# EAGLE design main (EAGLE 9.5.1)
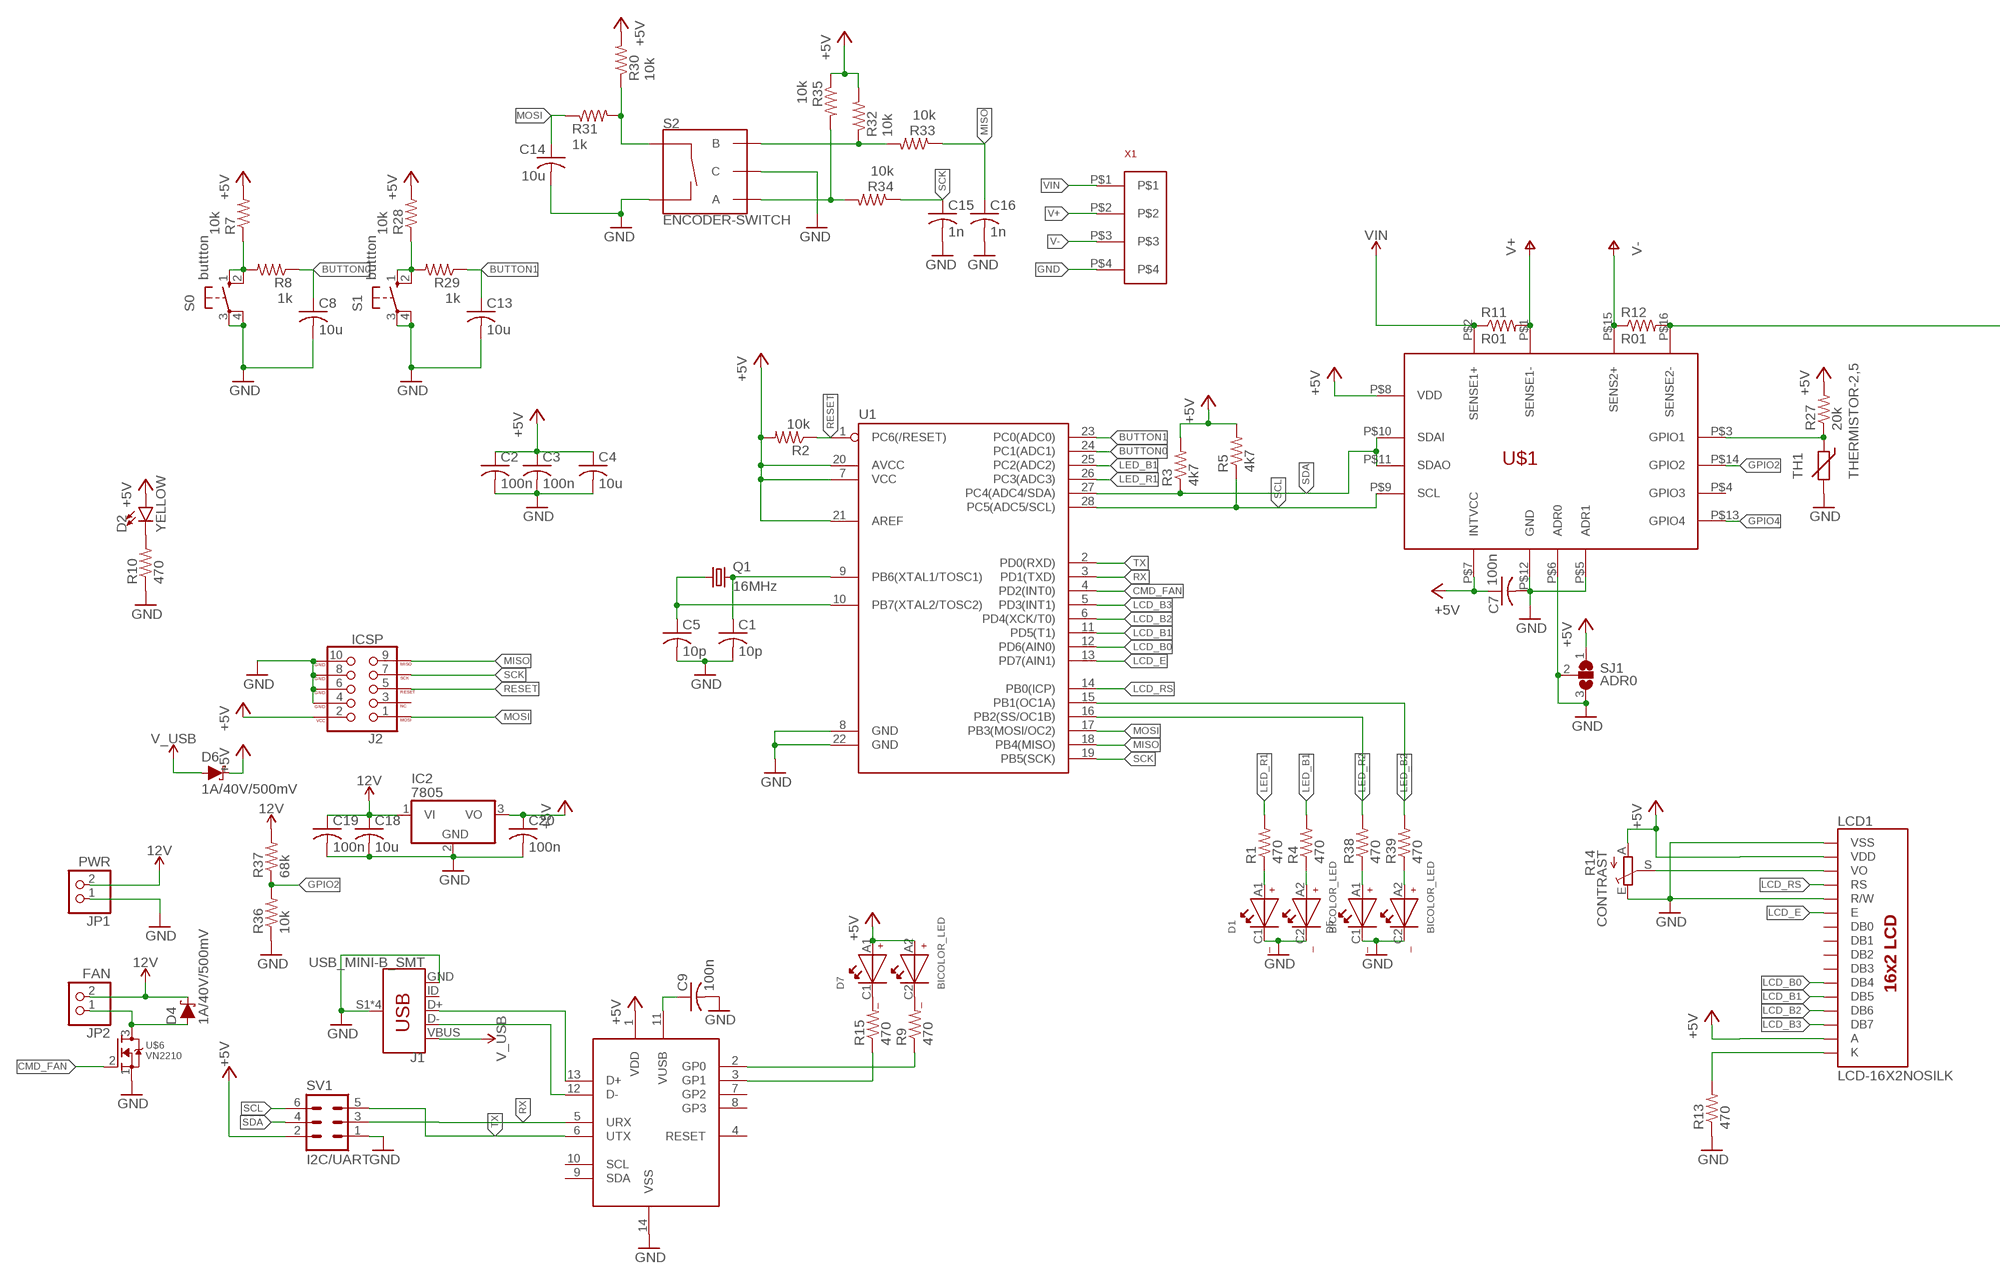
[diagram p0: schematic, sheet 1, part 1 of 2]
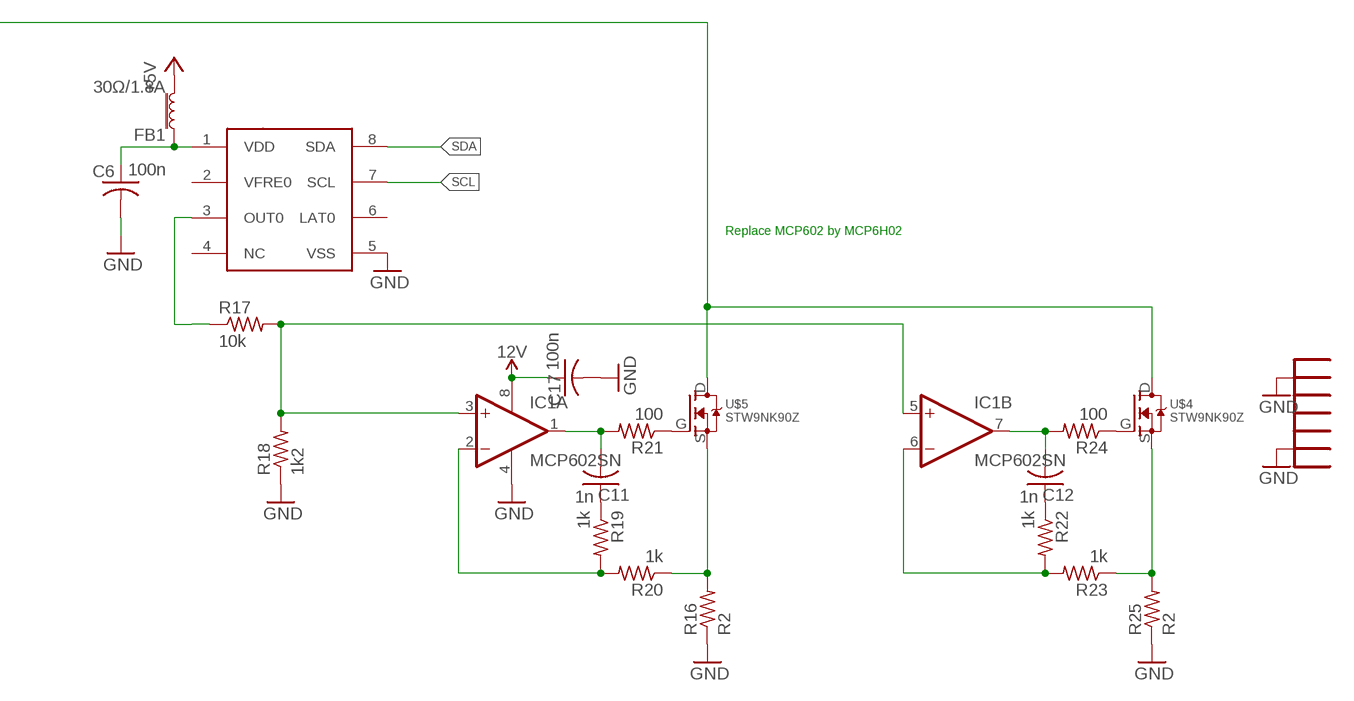
[diagram p1: schematic, sheet 1, part 2 of 2]

## Parts
BR1  MCP2221A  [DIP14]
C1  10p  C-USC0603  [C0603]
C2  100n  C-USC0603  [C0603]
C3  100n  C-USC0603  [C0603]
C4  10u  C-USC1206  [C1206]
C5  10p  C-USC0603  [C0603]
C6  100n  C-USC0603  [C0603]
C7  100n  C-USC0603  [C0603]
C8  10u  C-USC0603  [C0603]
C9  100n  C-USC0603  [C0603]
C11  1n  C-USC0805  [C0805]
C12  1n  C-USC0805  [C0805]
C13  10u  C-USC0603  [C0603]
C14  10u  C-USC0603  [C0603]
C15  1n  C-USC0603  [C0603]
C16  1n  C-USC0603  [C0603]
C17  100n  C-USC0603  [C0603]
C18  10u  C-USC1206  [C1206]
C19  100n  C-USC0603  [C0603]
C20  100n  C-USC0603  [C0603]
D1  BICOLOR_LED  [BICOLOR_LED]
D2  YELLOW  LED3MM  [LED_3MM]
D4  1A/40V/500mV  DIODE-SCHOTTKY-SS14  [SMA-DIODE]
D5  BICOLOR_LED  [BICOLOR_LED]
D6  1A/40V/500mV  DIODE-SCHOTTKY-SS14  [SMA-DIODE]
D7  BICOLOR_LED  [BICOLOR_LED]
FB1  30Ω/1.8A  FERRITE_BEAD-0603  [0603]
IC1  MCP602SN  [SO08]
IC2  7805  786TV  [TO220V]
J1  USB_MINI-B_SMT  [USB-MINIB]
J2  ICSP  AVR_SPI_PROG_5X2PTH2  [2X5-SHROUDED]
JP1  PWR  PINHD-1X2  [1X02]
JP2  FAN  PINHD-1X2  [1X02]
LCD1  LCD-16X2NOSILK  [LCD-16X2_NOSILK]
Q1  16MHz  CRYSTALHC49U70  [HC49U70]
R1  470  R-US_R0805  [R0805]
R2  10k  R-US_R0805  [R0805]
R3  4k7  R-US_R0805  [R0805]
R4  470  R-US_R0805  [R0805]
R5  4k7  R-US_R0805  [R0805]
R7  10k  R-US_R0805  [R0805]
R8  1k  R-US_R0805  [R0805]
R9  470  R-US_R0805  [R0805]
R10  470  R-US_R0805  [R0805]
R11  R01  R-US_R2512  [R2512]
R12  R01  R-US_R2512  [R2512]
R13  470  R-US_R0805  [R0805]
R14  CONTRAST  TRIM_EU-RJ9W  [RJ9W]
R15  470  R-US_R0805  [R0805]
R16  R2  R-US_R2512  [R2512]
R17  10k  R-US_R0805  [R0805]
R18  1k2  R-US_R0805  [R0805]
R19  1k  R-US_R0805  [R0805]
R20  1k  R-US_R0805  [R0805]
R21  100  R-US_R0805  [R0805]
R22  1k  R-US_R0805  [R0805]
R23  1k  R-US_R0805  [R0805]
R24  100  R-US_R0805  [R0805]
R25  R2  R-US_R2512  [R2512]
R27  20k  R-US_R0805  [R0805]
R28  10k  R-US_R0805  [R0805]
R29  1k  R-US_R0805  [R0805]
R30  10k  R-US_R0805  [R0805]
R31  1k  R-US_R0805  [R0805]
R32  10k  R-US_R0805  [R0805]
R33  10k  R-US_R0805  [R0805]
R34  10k  R-US_R0805  [R0805]
R35  10k  R-US_R0805  [R0805]
R36  10k  R-US_R0805  [R0805]
R37  68k  R-US_R0805  [R0805]
R38  470  R-US_R0805  [R0805]
R39  470  R-US_R0805  [R0805]
S0  buttton  10-XX  [B3F-10XX]
S1  buttton  10-XX  [B3F-10XX]
S2  ENCODER-SWITCH  [ROTARY_ENC_PLAIN]
SJ1  ADR0  SJ2W  [SJ_2]
SV1  I2C/UART  MA03-2  [MA03-2]
TH1  THERMISTOR-2,5  [RS-2,5]
U1  328P  ATMEGA328P_PDIP  [DIP28]
U$1  LTC2992  [MSOP16]
U$2  HEATSINK_0NOSILK  [HEATSINK_01]
U$3  MCP47FEB21  [TSSOP8]
U$4  STW9NK90Z  [TO247BV]
U$5  STW9NK90Z  [TO247BV]
U$6  VN2210  [TO92]
X1  SCREWTERM_5MM_4WAY  [SCREWTERM_5MM_4WAY]

## Nets
12V: C17.1 C18.1 C19.1 D4.C IC1.8(P:V+) IC2.1(VI) JP1.2 JP2.2 R37.2
+5V: BR1.1(VDD) C2.1 C3.1 C4.1 C7.1 C20.1 D2.A D6.C D7.A1 D7.A2 FB1.2 IC2.3(VO) J2.2(VCC) LCD1.2(VDD) LCD1.15(A) R2.2 R3.2 R5.2 R7.2 R14.A R27.2 R28.2 R30.2 R32.2 R35.1 SJ1.1 SV1.2 U1.7(VCC) U1.20(AVCC) U1.21(AREF) U$1.P$7(INTVCC) U$1.P$8(VDD)
B0: R7.1 R8.2 S0.1(S) S0.2(S1)
B1: R28.1 R29.2 S1.1(S) S1.2(S1)
BUTTON0: C8.1 R8.1 U1.24(PC1(ADC1))
BUTTON1: C13.1 R29.1 U1.23(PC0(ADC0))
CMD_FAN: U1.4(PD2(INT0)) U$6.2(G)
D+: BR1.13(D+) J1.D+
D-: BR1.12(D-) J1.D-
DAC_OUT: R17.1 U$3.3(OUT0)
FANNEG: D4.A JP2.1 U$6.3(D)
GND: BR1.14(VSS) C1.2 C2.2 C3.2 C4.2 C5.2 C6.2 C7.2 C8.2 C9.2 C13.2 C14.2 C15.2 C16.2 C17.2 C18.2 C19.2 C20.2 D1.C1 D1.C2 D5.C1 D5.C2 IC1.4(P:V-) IC2.2(GND) J1.GND J1.S1(SHIELD) J1.S2(SHIELD) J1.S3(SHIELD) J1.S4(SHIELD) J2.4(GND) J2.6(GND) J2.8(GND) J2.10(GND) JP1.1 LCD1.1(VSS) LCD1.5(R/W) R10.1 R13.1 R14.E R16.1 R18.1 R25.1 R36.1 S0.3(P) S0.4(P1) S1.3(P) S1.4(P1) S2.C S2.SW- SJ1.2 SJ1.3 SV1.1 TH1.2 U1.8(GND) U1.22(GND) U$1.P$5(ADR1) U$1.P$6(ADR0) U$1.P$12(GND) U$2.P$1 U$2.P$2 U$3.5(VSS) U$6.1(S) X1.P$4
GPIO2: R36.2 R37.1 U$1.P$14(GPIO2)
GPIO4: U$1.P$13(GPIO4)
LCD1_CONTRAST: LCD1.3(VO) R14.S
LCD1_K: LCD1.16(K) R13.2
LCD_B0: LCD1.11(DB4) U1.12(PD6(AIN0))
LCD_B1: LCD1.12(DB5) U1.11(PD5(T1))
LCD_B2: LCD1.13(DB6) U1.6(PD4(XCK/T0))
LCD_B3: LCD1.14(DB7) U1.5(PD3(INT1))
LCD_E: LCD1.6(E) U1.13(PD7(AIN1))
LCD_RS: LCD1.4(RS) U1.14(PB0(ICP))
LED_B1: R4.2 U1.25(PC2(ADC2))
LED_B2: R39.2 U1.15(PB1(OC1A))
LED_R1: R1.2 U1.26(PC3(ADC3))
LED_R2: R38.2 U1.16(PB2(SS/OC1B))
MISO: C16.1 J2.9(MISO) R33.1 U1.18(PB4(MISO))
MOSI: C14.1 J2.1(MOSI) R31.1 U1.17(PB3(MOSI/OC2))
N$1: C1.1 Q1.2 U1.9(PB6(XTAL1/TOSC1))
N$2: C5.1 Q1.1 U1.10(PB7(XTAL2/TOSC2))
N$3: C6.1 FB1.1 U$3.1(VDD)
N$4: D5.A1 R38.1
N$5: D5.A2 R39.1
N$6: D1.A1 R1.1
N$7: R21.1 U$5.G
N$8: D1.A2 R4.1
N$9: BR1.2(GP0) R9.1
N$10: BR1.11(VUSB) C9.1
N$11: BR1.3(GP1) R15.1
N$12: D7.C1 R15.2
N$13: D7.C2 R9.2
N$14: D2.K(C) R10.2
N$20: C11.1 R19.1
N$23: C12.1 R22.1
N$29: R12.2 U$1.P$16(SENSE2-) U$4.D U$5.D
RESET: J2.5(RESET) R2.1 U1.1(PC6(/RESET))
RX: BR1.5(URX) SV1.3 U1.3(PD1(TXD))
SCK: C15.1 J2.7(SCK) R34.1 U1.19(PB5(SCK))
SCL: R5.1 SV1.6 U1.28(PC5(ADC5/SCL)) U$1.P$9(SCL) U$3.7(SCL)
SDA: R3.1 SV1.4 U1.27(PC4(ADC4/SDA)) U$1.P$10(SDAI) U$1.P$11(SDAO) U$3.8(SDA)
TX: BR1.6(UTX) SV1.5 U1.2(PD0(RXD))
V+: R11.2 U$1.P$1(SENSE1-) X1.P$2
V-: R12.1 U$1.P$15(SENS2+) X1.P$3
V_USB: D6.A J1.VBUS
VCTRL: IC1.3(A:+IN) IC1.5(B:+IN) R17.2 R18.2
VENC: R30.1 R31.2 S2.SW+
VENCA: R34.2 R35.2 S2.A
VENCB: R32.1 R33.2 S2.B
VFB1: IC1.2(A:-IN) R19.2 R20.2
VFB2: IC1.6(B:-IN) R22.2 R23.2
VG2: R24.1 U$4.G
VIN: R11.1 U$1.P$2(SENSE1+) X1.P$1
VO1: C11.2 IC1.1(A:OUT) R21.2
VO2: C12.2 IC1.7(B:OUT) R24.2
VS1: R16.2 R20.1 U$5.S
VS2: R23.1 R25.2 U$4.S
VT: R27.1 TH1.1 U$1.P$3(GPIO1)
Unconnected: BR1.4(RESET) BR1.7(GP2) BR1.8(GP3) BR1.9(SDA) BR1.10(SCL) J1.ID J2.3(NC) LCD1.7(DB0) LCD1.8(DB1) LCD1.9(DB2) LCD1.10(DB3) U$1.P$4(GPIO3) U$3.2(VFRE0) U$3.4(NC) U$3.6(LAT0)

## Notes on the sheet
- Replace MCP602 by MCP6H02

## Library data of the parts
BR1 = 7_segment_lib:MCP2221A
C1-C9 C11-C20 = rcl:C-US: CAPACITOR, American symbol; SPICEPREFIX: C
D1 D5 D7 = 7_segment_lib:BICOLOR_LED
D2 = SparkFun-LED:LED: LED (Generic) Standard schematic elements and footprints for 5mm, 3mm, 1206, and 0603 sized LEDs. Generic LEDs with no color specified.; PROD_ID: DIO-08794
D4 D6 = SparkFun-DiscreteSemi:DIODE-SCHOTTKY: Schottky diode A Schottky diode is a semiconductor diode which has a low forward voltage drop and a very fast switching action.; PROD_ID: DIO-08053
FB1 = SparkFun-Coils:FERRITE_BEAD: Ferrite Bead (blocks, cores, rings, chokes, etc.) Inductor with layers of ferrite used to suppress high frequencies. Often used to isolate high frequency noise. SparkFun Products: IOIO-OTG - V2.2 <https://www.sparkfun.com/products/13613> SparkFun SAMD21 Mini Breakout <https://www.sparkfun.com/products/13664> SparkFun 6 Degrees of Freedom Breakout - LSM6DS3 <https://www.sparkfun.com/products/13339> SparkFun SAMD21 Dev Breakout <https://www.sparkfun.com/products/13672>; PROD_ID: NDUC-07859
IC1 = linear:MCP602: Single Op Amp 2.7V to 6.0V Single Supply CMOS Source: http://ww1.microchip.com/downloads/en/DeviceDoc/21314g.pdf
IC2 = linear:78*: Positive VOLTAGE REGULATOR Source: http://cache.national.com/ds/LM/LM78L05.pdf http://www.fairchildsemi.com/ds/LM/LM7805.pdf
J1 = SparkFun-Connectors:USB_MINI-B: USB type Mini-B Connector Breaks out 5th pin, and includes shield pins if needed. SparkFun Products: SparkFun FTDI Basic Breakout <https://www.sparkfun.com/products/9716> SparkFun XBee Explorer USB <https://www.sparkfun.com/products/11812> SparkFun Redboard <https://www.sparkfun.com/products/12757>; PROD_ID: CONN-08193; SF_ID: PRT-00587
J2 = SparkFun-Connectors:AVR_SPI_PROG_5X2: AVR 10-pin ICSP Header This is the standard AVR In Circuit Serial Programming header. Minimal, but includes pin one indicator. Works with standard Olimex programmers. SparkFun Products: 2x5 AVR ICSP Male Header <https://www.sparkfun.com/products/778> - PTH 2x5 Pin Shrouded Header <https://www.sparkfun.com/products/8506> - PTH2; PROD_ID: CONN-08671; SF_ID: PRT-08506
JP1 JP2 = pinhead:PINHD-1X2: PIN HEADER
LCD1 = 7_segment_lib:LCD-16X2: Standard text-only 16x2 parallel input LCD Basic 16 character by 2 line display. Typically utilizes the extremely common HD44780 parallel interface chipset SparkFun Products: Basic 16x2 Green <https://www.sparkfun.com/products/255> Basic 8x2 Green <https://www.sparkfun.com/products/11122>; SF_ID: LCD-00255
Q1 = crystal:CRYSTAL: CRYSTAL; OC_FARNELL: unknown; OC_NEWARK: unknown
R1-R5 R7-R13 R15-R25 R27-R39 = rcl:R-US_: RESISTOR, American symbol; SPICEPREFIX: R
R14 = pot:TRIM_EU-: POTENTIOMETER
S0 S1 = DC_LOAD_AU:10-XX: OMRON SWITCH; MPN: B3F-1000; OC_FARNELL: 176432; OC_NEWARK: 36M3542
S2 = SparkFun-Switches:ENCODER-SWITCH: Rotary Encoder w/ Select Switch Encoders rotate similarly to potentiometers, but they’re different from potentiometers in that an encoder has full rotation without limits. They output gray code so that you can tell how much and in which direction the encoder has been turned. This encoder includes a push-down select switch built into the shaft. SparkFun Products Rotary Encoder <https://www.sparkfun.com/products/9117> (COM-09117); SF_SKU: COM-09117
SJ1 = jumper:SJ2W: SMD solder JUMPER
SV1 = con-lstb:MA03-2: PIN HEADER; OC_FARNELL: unknown; OC_NEWARK: unknown
TH1 = varistor:THERMISTOR: THERMISTOR
U1 = 7_segment_lib:ATMEGA328P_PDIP: Atmel 328P Through hole ATMEGA328P uC used in the Arduino 32kb flash, 1k EEPROM, 2k SRAM Datasheet <http://www.sparkfun.com/datasheets/Components/SMD/ATMega328.pdf> SparkFun Products Storefront component: AVR 28 Pin 20MHz 32K 6A/D - ATMega328P <https://www.sparkfun.com/products/9061> (COM-09061) SparkFun Simon Says - Through-Hole Soldering Kit <https://www.sparkfun.com/products/10547> (KIT-10547) SparkFun Learn to Solder - Simon Says <https://www.sparkfun.com/products/13708> (KIT-13708) SparkFun BigTime Watch Kit <https://www.sparkfun.com/products/11734> (KIT-11734) SparkFun ClockIt <https://www.sparkfun.com/products/10930> (KIT-10930) SparkFun Serial Enabled LCD Kit <https://www.sparkfun.com/products/10097> (LCD-10097) SparkFun Simon Tilts - Through Hole Soldering Kit <https://www.sparkfun.com/products/12634> (KIT-12634) SparkFun Frequency Counter Kit <https://www.sparkfun.com/products/10140> (KIT-10140) FabFM Radio Kit <https://www.sparkfun.com/products/11043> (KIT-11043) SparkFun Binary Blaster Kit <https://www.sparkfun.com/products/12037> (KIT-12037) SparkFun Metro-Gnome <https://www.sparkfun.com/products/9236> (KIT-09236) ATmega328 with Arduino Optiboot (Uno) <https://www.sparkfun.com/products/10524> (DEV-10524); PROD_ID: IC-09136
U$1 = 7_segment_lib:LTC2992
U$2 = 7_segment_lib:HEATSINK_0
U$3 = 7_segment_lib:MCP47FEB21
U$4 U$5 = 7_segment_lib:STW9NK90Z
U$6 = 7_segment_lib:VN2210
X1 = 7_segment_lib:SCREWTERM_5MM_4WAY

## Board
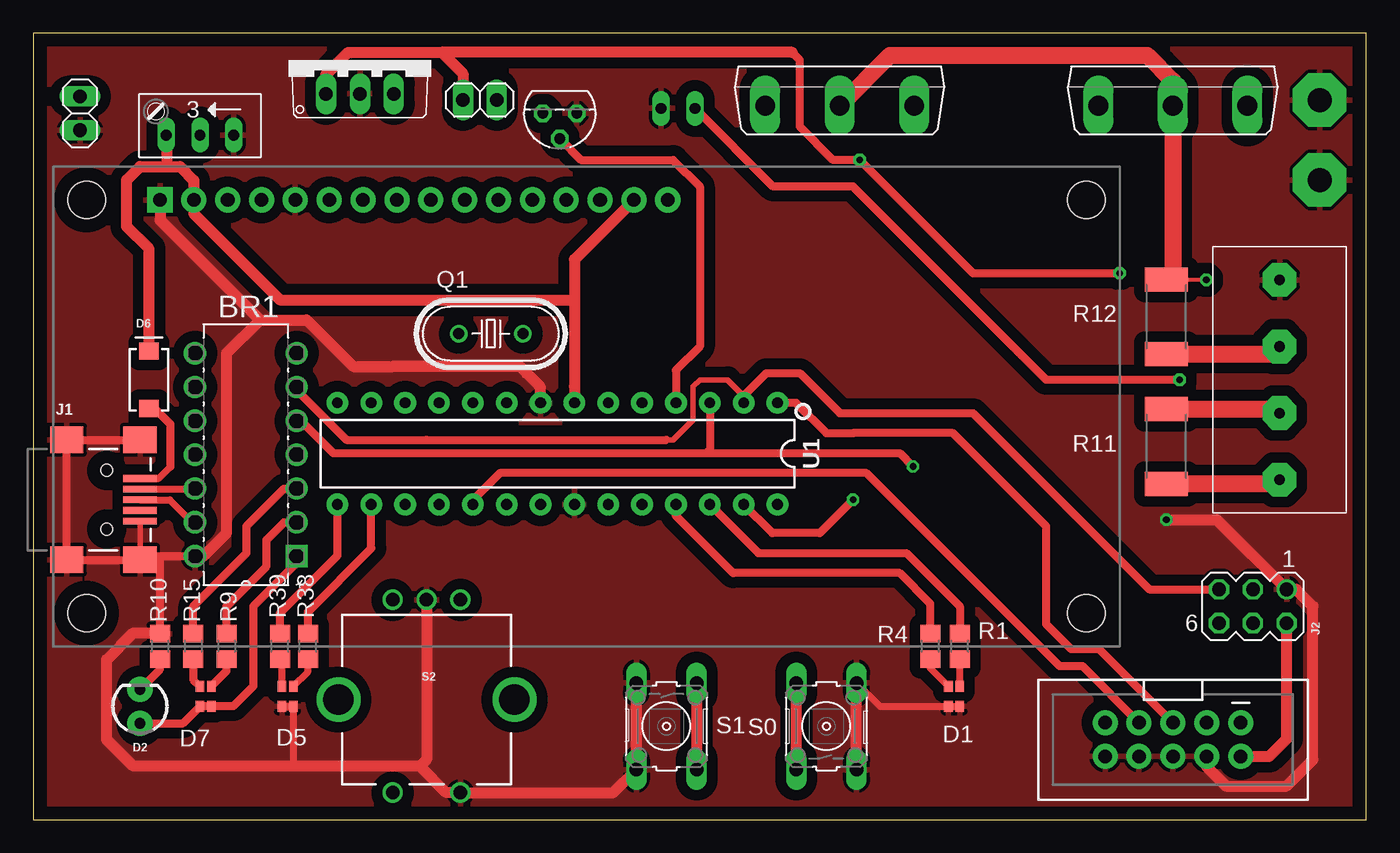
[diagram p2: board, top side]
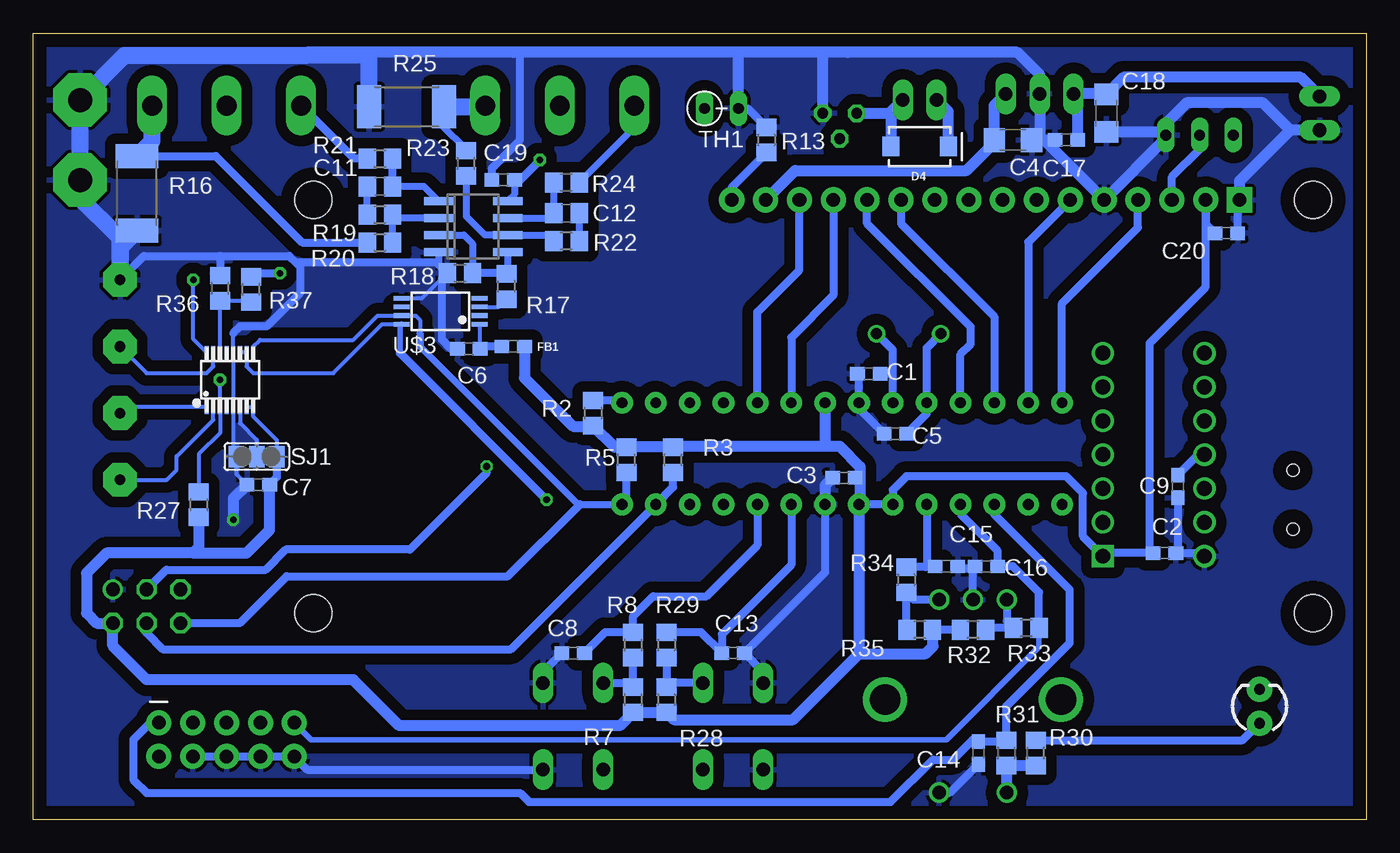
[diagram p3: board, bottom side, seen from below]

Size 100 x 59 mm. Coordinates in mm from the lower left corner, seen from the top.
Outline: 0,0 100,0 100,59 0,59 0,0
Copper layers (1*16): Top 0.035mm / dielectric 1.5mm / Bottom 0.035mm
Design rules "default": minimum track width 6mil, minimum drill 0.35mm, track to track 6mil, track to pad 6mil, pad to pad 6mil, via to via 6mil, smd to smd 6mil, copper to edge 40mil, drill to drill 6mil, minimum pad ring 10mil, minimum via ring 8mil, stop-mask expansion 4mil, vias tented up to drill 0mil, thermal gap 10mil

### Footprints (pad centres in the part's own frame; a part is rotated, then mirrored left to right if it is on the bottom)
DIP14 = drill 1.118 square: 1 -7.62,15.24 | drill 1.118: 2 -7.62,12.7; 3 -7.62,10.16; 4 -7.62,7.62; 5 -7.62,5.08; 6 -7.62,2.54; 7 -7.62,0; 8 0,0; 9 0,2.54; 10 0,5.08; 11 0,7.62; 12 0,10.16; 13 0,12.7; 14 0,15.24
C0603 = smd 1.1 x 1: 1 -0.85,0; 2 0.85,0
C1206 = smd 1.6 x 1.8: 1 -1.4,0; 2 1.4,0
C0805 = smd 1.3 x 1.5: 1 -0.95,0; 2 0.95,0
BICOLOR_LED = smd 0.8 x 0.65: A1 0,0; A2 0,-0.85; C1 1.5,0; C2 1.5,-0.85
LED_3MM = drill 0.813 pad 1.88: A -1.27,0; K 1.27,0
SMA-DIODE = smd 1.27 x 1.47: A -2.15,0; C 2.15,0
0603 = smd 1.1 x 1: 1 -0.85,0; 2 0.85,0
SO08 = smd 0.6 x 2.2: 1 -1.905,-2.6; 2 -0.635,-2.6; 3 0.635,-2.6; 4 1.905,-2.6; 5 1.905,2.6; 6 0.635,2.6; 7 -0.635,2.6; 8 -1.905,2.6
TO220V = drill 1.016 long: 1 -2.54,-2.54; 2 0,-2.54; 3 2.54,-2.54
USB-MINIB = smd 2.5 x 0.5: D+ 2.5,0; D- 2.5,0.8; GND 2.5,-1.6; ID 2.5,-0.8; VBUS 2.5,1.6 | smd 2.5 x 2: S1 -3,4.5; S2 2.5,4.5; S3 -3,-4.5; S4 2.5,-4.5 | hole 0.9: 0,2.2; 0,-2.2
2X5-SHROUDED = drill 1.016 pad 1.88: 1 -1.27,5.08; 2 1.27,5.08; 3 -1.27,2.54; 4 1.27,2.54; 5 -1.27,0; 6 1.27,0; 7 -1.27,-2.54; 8 1.27,-2.54; 9 -1.27,-5.08; 10 1.27,-5.08
1X02 = drill 1.016 long: 1 -1.27,0; 2 1.27,0
LCD-16X2_NOSILK = drill 1.016 pad 1.88 square: 1 -32,15.5 | drill 1.016 pad 1.88: 2 -29.46,15.5; 3 -26.92,15.5; 4 -24.38,15.5; 5 -21.84,15.5; 6 -19.3,15.5; 7 -16.76,15.5; 8 -14.22,15.5; 9 -11.68,15.5; 10 -9.14,15.5; 11 -6.6,15.5; 12 -4.06,15.5; 13 -1.52,15.5; 14 1.02,15.5; 15 3.56,15.5; 16 6.1,15.5 | hole 2.8: -37.5,15.5; -37.5,-15.5; 37.5,15.5; 37.5,-15.5
HC49U70 = drill 0.813: 1 -2.413,0; 2 2.413,0
R0805 = smd 1.3 x 1.5: 1 -0.95,0; 2 0.95,0
R2512 = smd 1.8 x 3.2: 1 -2.8,0; 2 2.8,0
RJ9W = drill 0.813 long: A 2.54,0.635; E -2.54,0.635; S 0,0.635
B3F-10XX = drill 1.016 long: 1 -3.251,2.261; 2 3.251,2.261; 3 -3.251,-2.261; 4 3.251,-2.261
ROTARY_ENC_PLAIN = drill 1.016: A 7.493,-2.54; B 7.493,2.54; C 7.493,0; SW+ -6.985,2.54; SW- -6.985,-2.54 | drill 2.286: P$3 0,6.604; P$4 0,-6.604
SJ_2 = smd 1.168 x 1.6: 1 -1.524,0; 2 0,0; 3 1.524,0
MA03-2 = drill 1.016: 1 -2.54,-1.27 | drill 1.016 octagon: 2 -2.54,1.27; 3 0,-1.27; 4 0,1.27; 5 2.54,-1.27; 6 2.54,1.27
RS-2,5 = drill 0.813 long: 1 -1.27,0; 2 1.27,0
DIP28 = drill 0.813 pad 1.626: 1 -16.51,-3.81; 2 -13.97,-3.81; 3 -11.43,-3.81; 4 -8.89,-3.81; 5 -6.35,-3.81; 6 -3.81,-3.81; 7 -1.27,-3.81; 8 1.27,-3.81; 9 3.81,-3.81; 10 6.35,-3.81; 11 8.89,-3.81; 12 11.43,-3.81; 13 13.97,-3.81; 14 16.51,-3.81; 15 16.51,3.81; 16 13.97,3.81; 17 11.43,3.81; 18 8.89,3.81; 19 6.35,3.81; 20 3.81,3.81; 21 1.27,3.81; 22 -1.27,3.81; 23 -3.81,3.81; 24 -6.35,3.81; 25 -8.89,3.81; 26 -11.43,3.81; 27 -13.97,3.81; 28 -16.51,3.81
MSOP16 = smd 0.3 x 1: P$1 -1,-2.05; P$2 -0.5,-2.05; P$3 0,-2.05; P$4 0.5,-2.05; P$5 1,-2.05; P$6 1.5,-2.05; P$7 2,-2.05; P$8 2.5,-2.05; P$9 2.5,2.05; P$10 2,2.05; P$11 1.5,2.05; P$12 1,2.05; P$13 0.5,2.05; P$14 0,2.05; P$15 -0.5,2.05; P$16 -1,2.05
HEATSINK_01 = drill 1.8 pad 4 octagon: P$1 0,-3; P$2 0,-9
TSSOP8 = smd 0.35 x 1.2: 1 -0.975,-2.925; 2 -0.325,-2.925; 3 0.325,-2.925; 4 0.975,-2.925; 5 0.975,2.925; 6 0.325,2.925; 7 -0.325,2.925; 8 -0.975,2.925
TO247BV = drill 1.499 long: D 0,-2.921; G -5.588,-2.921; S 5.588,-2.921
TO92 = drill 0.813 octagon: 1 -1.27,0; 2 0,1.905; 3 1.27,0
SCREWTERM_5MM_4WAY = drill 0.8 pad 2.54 octagon: P$1 -7.5,0; P$2 -2.5,0; P$3 2.5,0; P$4 7.5,0

### Placement (x,y rotation side)
BR1  12.13,35 180 top
C1  37.33,33.46 180 bottom
C2  15.13,20 0 bottom
C3  39.18,25.64 180 bottom
C4  26.5,51 0 bottom
C5  35.33,28.96 180 bottom
C6  67.33,35.33 180 bottom
C7  83.12,25.12 180 bottom
C8  59.5,12.5 180 bottom
C9  14.13,25 270 bottom
C11  74,47.5 0 bottom
C12  60,45.5 180 bottom
C13  47.5,12.5 0 bottom
C14  29.1,5 270 bottom
C15  31.5,19 0 bottom
C16  28.5,19 180 bottom
C17  22.5,51 180 bottom
C18  19.5,53 270 bottom
C19  64.75,48 180 bottom
C20  10.5,44 0 bottom
D1  69.5,10 270 top
D2  8,8.5 90 top
D4  33.5,50.5 0 bottom
D5  19.5,10 270 top
D6  8.68,33 90 top
D7  12.5,8.5 90 top
FB1  64,35.5 0 bottom
IC1  67,44.5 270 bottom
IC2  24.5,57 0 top
J1  5.5,24 0 top
J2  85.5,6 270 top
JP1  3.5,53 90 top
JP2  33.5,54 180 top
LCD1  41.5,31 0 top
Q1  34.33,36.46 0 top
R1  69.5,13 90 top
R2  58,30.5 270 bottom
R3  52,27 90 bottom
R4  67.3,13 90 top
R5  55.5,27 90 bottom
R7  55,9 270 bottom
R8  55,13.1 270 bottom
R9  14.5,13 270 top
R10  9.5,13 270 top
R11  85,28 90 top
R12  85,37.73 90 top
R13  45,51 270 bottom
R14  12.5,52 180 top
R15  12,13 270 top
R16  92.22,46.98 90 bottom
R17  64.5,40 90 bottom
R18  68,41 0 bottom
R19  74,45.4 0 bottom
R20  74,43.3 0 bottom
R21  74,49.6 0 bottom
R22  60,43.4 180 bottom
R23  67.55,49.25 270 bottom
R24  60,47.8 180 bottom
R25  72,53.5 0 bottom
R27  87.58,23.64 270 bottom
R28  52.5,9 270 bottom
R29  52.5,13.1 270 bottom
R30  24.8,5 90 bottom
R31  27,5 270 bottom
R32  29.5,14.25 180 bottom
R33  25.5,14.36 180 bottom
R34  34.5,18 270 bottom
R35  33.5,14.25 180 bottom
R36  86,39.87 270 bottom
R37  83.64,39.78 90 bottom
R38  20.6,13 90 top
R39  18.5,13 90 top
S0  59.5,7 90 top
S1  47.5,7 270 top
S2  29.5,9 90 top
SJ1  83.23,27.23 180 bottom
SV1  91.5,16 180 top
TH1  48.37,53.37 0 bottom
U1  39.33,27.46 180 top
U$1  86,33 0 bottom
U$2  96.5,57 0 top
U$3  69.45,38.14 90 bottom
U$4  60.5,56.5 0 top
U$5  85.5,56.5 0 top
U$6  39.5,53 180 top
X1  93.5,33 90 top

### Tracks (layer width: path | path; a pad name or v marks a point on that pad's centre or on a via)
12V  (via drill 0.5)
  Top 0.61: 56.92,57.58 57.5,57 57.5,52 60,49.5 v62,49.5 70.5,41 v81.5,41
  Top 0.813: IC2.1 21.96,55.91 23.63,57.58 30.63,57.58 | JP2.2 32.23,55.98 30.63,57.58 | 56.92,57.58 30.63,57.58
  Bottom 0.508: C19.1 63.9,46.91 IC1.8
  Bottom 0.61: C19.1 63.5,48 v62,49.5 | R37.2 83.38,41 v81.5,41
  Bottom 0.813: C17.1 21.65,54.15 IC2.1 19.56,54.46 C18.1 18.21,55.69 4.92,55.69 JP1.2 | D4.C 31.35,53.12 JP2.2
+5V
  Top 0.61: D2.A 11.23,7.23 D7.A1 D7.A2 15,8.5 16.5,10 16.5,16 19.75,19.25 BR1.1
  Top 0.813: D6.C 8.68,42.83 7,44.5 7,48 8,49 10,49 | 10,49 11,49 12.04,47.96 LCD1.2 12.04,45.46 18.5,39 40.59,39 | R14.A 10,51.33 10,49 | U1.7 40.59,32.5 40.59,39 | LCD1.15 40.59,42.03 40.59,39 | J2.2 92.73,4.73 94.04,6.04 SV1.2
  Bottom 0.305: U$1.P$7 U$1.P$8 83.5,30.25 81.71,28.46 SJ1.1
  Bottom 0.61: C20.1 12.04,44.69 LCD1.2 12.04,39.96 16.25,35.75 16.25,20.27 C2.1 19.52,20 BR1.1 21.25,21.25 21.25,24.5 22.5,25.75 34.5,25.75 35.52,24.73 U1.20 U1.21 | R32.2 R35.1 | C7.1 81.71,25.69 SJ1.1 | R30.2 9.28,5.95 D2.A
  Bottom 0.813: IC2.3 27.9,53.6 C4.1 27.9,50.78 29.98,48.7 42.85,48.7 LCD1.15 | 38.05,12.45 U1.21 37.98,23.73 37.98,25.5 | 38.05,12.45 43,7.5 51.95,7.5 R28.2 R7.2 56,7.05 72.55,7.05 76,10.5 91.5,10.5 94.04,13.04 SV1.2 95.23,14.73 96,15.5 96,18.5 94.5,20 88,20 | 38.05,12.45 33.05,12.45 32.5,13 32.5,14.2 R35.1 | 40.5,28 39.5,28 37.98,26.48 37.98,25.5 | 40.5,28 51.95,28 R3.2 R5.2 56.4,27.95 R2.2 58.05,29.5 59.5,29.5 63.15,33.15 FB1.2 | U1.7 40.59,28.09 40.5,28 | R27.2 87.58,20.42 88,20 | C7.1 82.28,21.73 84,20 88,20 | C3.1 38.19,25.5 37.98,25.5
B0
  Top 0.813: S0.1 S0.2
  Bottom 0.61: R7.1 55,10 | 55,10 R8.2 | S0.2 55,10.25 55,10
B1
  Top 0.813: S1.1 S1.2
  Bottom 0.61: R29.2 52.5,10.5 | 52.5,10.5 R28.1 | S1.1 52.5,10.25 52.5,10.5
BUTTON0
  Bottom 0.61: C8.1 57.1,14.05 R8.1 55,15.25 53.5,16.75 49.5,16.75 45.67,20.57 U1.24
BUTTON1
  Bottom 0.61: R29.1 49.9,14.05 C13.1 48.35,13.9 43.13,19.11 U1.23
CMD_FAN
  Top 0.61: U$6.2 41.09,49.5 48,49.5 50,47.5 50,35.5 48.22,33.72 U1.4
D+
  Top 0.508: J1.D+ 10.23,24 11.94,22.3 BR1.13
D-
  Top 0.508: J1.D- 12.1,24.8 BR1.12
DAC_OUT
  Bottom 0.305: U$3.3 65.08,38.47 R17.1
FANNEG
  Bottom 0.813: JP2.1 35.65,53.12 | 35.65,53.12 D4.A | U$6.3 35.77,53 35.65,53.12
GND  (via drill 0.5)
  Top 0.406: J1.GND 8,19.75 7.76,19.5
  Top 0.508: D1.C1 D1.C2 63.51,8.5 S0.4 | D5.C1 19.5,4
  Top 0.61: J1.S4 7.76,19.5 J1.S3 J1.S1 J1.S2 | BR1.14 10.93,19.76 9.5,19.76 | 9.5,19.76 8.02,19.76 8,19.75 | R10.1 9.5,19.76 | D5.C2 D5.C1
  Top 0.813: U1.8 38.05,32.45 37,33.5 36.5,34 27,34 24,34 20.5,37.5 17,37.5 | LCD1.1 9.5,45 17,37.5 | 29,4 30.98,2.01 S2.SW- 43.51,2.01 S1.4 S1.3 | R10.1 9.45,14 7.5,14 5.5,12 5.5,6 7.5,4 19.5,4 29,4 | S2.C 29.5,4.5 29,4 | BR1.14 12.76,19.76 14.5,21.5 14.5,35 17,37.5 | S0.3 S0.4 | J2.4 88.04,3.96 89.5,2.5 94,2.5 96,4.5 96,16 94.73,17.27 SV1.1 88.81,22.5 v85,22.5
  Bottom 0.254: SJ1.2 SJ1.3
  Bottom 0.305: U$3.5 70.83,39.12 R18.1 | C7.2 84.76,25.91 SJ1.3 85,27.47 U$1.P$5 U$1.P$12 85,36.5 84.5,37 82.5,37 | 80.25,39.25 80,39.5 80,41.5 | U$1.P$6 84.5,29.75 83.23,28.48 SJ1.2
  Bottom 0.508: IC1.4 69.6,41.65 R18.1
  Bottom 0.61: C20.2 9.65,46.35 LCD1.1 | C1.2 38.05,33.34 U1.8 38.05,30.84 C5.2 | 40.59,25.04 U1.22 40.59,18.55 C13.2 45.24,11.09 S1.3 | C8.2 61.76,11.09 S0.4 | C2.2 14.11,20 | 14.11,20 12.38,20 BR1.14 | C9.2 14.13,20.03 14.11,20 | S2.C 29.5,18.85 | 29.5,18.85 C16.2 | C15.2 30.5,18.85 29.5,18.85 | J2.4 J2.6 J2.8 J2.10 79.44,3.75 S0.3 | 86,42.3 R36.1 | X1.P$4 91.7,42.3 86,42.3 | S2.SW- 31.23,2.01 C14.2 | C19.2 65.6,48.9 63.5,51 63.5,57.58 | TH1.2 46.41,53.37 R13.1 | 86,42.3 80.8,42.3 80.3,41.8 | 80.3,41.8 80,41.5 80,39.5 80.25,39.25 82.5,37 84.5,37 85,36.5 | 80.3,41.8 69.75,41.8 R18.1 69.35,40.6 69.35,36.01 68.67,35.33 C6.2
  Bottom 0.813: C17.2 24.27,51 | 24.27,51 C4.2 | 24.27,51 24.16,51 LCD1.5 15.04,51.12 | 15.04,51.12 R14.E 15.28,51.6 C18.2 | 24.27,51 24.5,51.23 IC2.2 24.5,55.91 26.17,57.58 38.89,57.58 40.77,57.58 | U$6.1 40.77,57.58 | 79.51,57.35 79.28,57.58 78.88,57.58 64,57.58 63.5,57.58 47.12,57.58 | 40.77,57.58 47.12,57.58 | TH1.2 47.1,57.58 47.12,57.58 | JP1.1 5.7,51.73 | 15.04,51.12 15.04,52.22 13.47,53.78 7.76,53.78 5.7,51.73 | LCD1.1 9.5,47.93 5.7,51.73 | 40.59,25.07 40.59,25.04 | 40.59,25.04 U1.22 | C7.2 85,24.1 v85,22.5 | 40.59,25.07 40.59,25.04 | C3.2 40.59,25.07
  Bottom 1.27: R16.1 93.5,42.91 X1.P$4 93.5,43.65 96.66,46.8 96.66,47.84 U$2.P$2 U$2.P$1 93.15,57.35 79.51,57.35 74.8,57.35 R25.1
  pour Bottom (isolate 0.813): 0,0 0,59 100,59 100,0
  pour Top (isolate 0.813): 0,0 0,59 100,59 100,0
GPIO2
  Bottom 0.305: U$1.P$14 R36.2 83.72,38.91 R37.1
LCD1_CONTRAST
  Bottom 0.61: LCD1.3 14.58,48.23 12.5,50.31 R14.S
LCD1_K
  Bottom 0.61: R13.2 47.6,47.45 LCD1.16
LCD_B0
  Bottom 0.61: LCD1.11 34.9,44.73 27.89,37.73 U1.12
LCD_B1
  Bottom 0.61: U1.11 30.43,34.91 29.66,35.69 29.66,36.96 37.44,44.73 LCD1.12
LCD_B2
  Bottom 0.61: LCD1.13 39.98,39.34 43.13,36.19 U1.6
LCD_B3
  Bottom 0.61: U1.5 45.67,38.09 42.52,41.24 LCD1.14
LCD_E
  Bottom 0.61: LCD1.6 25.36,43.34 U1.13
LCD_RS
  Bottom 0.61: U1.14 22.82,38.73 17.12,44.42 LCD1.4
LED_B1
  Top 0.61: R4.2 67.3,16.2 65,18.5 52.5,18.5 48.22,22.79 U1.25
LED_B2
  Top 0.61: R39.2 18.5,15.5 22.82,19.82 U1.15
LED_R1
  Top 0.61: U1.26 54.41,20 65.5,20 69.5,16 R1.2
LED_R2
  Top 0.61: R38.2 20.6,15.6 25.36,20.36 U1.16
MISO
  Bottom 0.406: J2.9 79.15,6 31.5,6 24.55,12.95 R33.1
  Bottom 0.61: U1.18 30.43,22.93 27.65,20.15 C16.1 26.5,19 24.55,17.05 24.55,14.7
  Bottom 0.813: R33.1 24.55,14.7
MOSI
  Bottom 0.61: U1.17 27.89,22.89 26.5,21.5 22.25,17.25 22.25,13.25 27,8.5 R31.1 27.1,5.85 C14.1 29.2,5.95 29.55,5.95 31,4.5 32.5,4.5 35.68,1.32 62.82,1.32 63.5,2 91.5,2 92.5,3 92.5,6 91.23,7.27 J2.1
N$1
  Bottom 0.61: U1.9 35.52,33.47 | 35.52,33.47 35.52,35.24 Q1.2 | C1.1 35.52,33.46 35.52,33.47
N$2
  Bottom 0.61: Q1.1 32.98,35.4 U1.10 32.98,30.46 C5.1
N$3
  Bottom 0.305: U$3.1 66.53,35.38 C6.1
  Bottom 0.61: FB1.1 66.3,35.5 C6.1
N$4
  Top 0.508: D5.A1 20.6,11.1 R38.1
N$5
  Top 0.508: D5.A2 18.65,11.9 R39.1
N$6
  Top 0.508: D1.A1 R1.1
N$7
  Bottom 0.61: R21.1 75.93,49.6 U$5.G
N$8
  Top 0.508: D1.A2 67.3,11.35 R4.1
N$9
  Top 0.61: R9.1 14.5,16 17.5,19 17.5,21 18.8,22.3 BR1.2
N$10
  Bottom 0.61: BR1.11 12.61,27.38 C9.1
N$11
  Top 0.61: BR1.3 18.82,24.84 16,22.02 16,20 12,16 R15.1
N$12
  Top 0.61: R15.2 12,10.5 D7.C1
N$13
  Top 0.61: D7.C2 14.5,11.15 R9.2
N$14
  Top 0.61: D2.K 9.5,11.27 R10.2
N$20
  Bottom 0.508: R19.1 C11.1
N$23
  Bottom 0.508: C12.1 R22.1
N$29  (via drill 0.5)
  Top 0.305: v88,40.5 86.03,40.5 85.5,41.03
  Top 1.27: U$4.D 64.27,57.35 83.57,57.35 85.5,55.41 U$5.D 85.5,41.03 R12.2
  Bottom 0.305: U$1.P$16 88,36.05 v88,40.5
RESET
  Top 0.61: J2.5 79.99,12.78 77.87,12.78 76,14.65 76,22 69,29 61.5,29 59.5,29 57.23,31.27 U1.1
  Bottom 0.61: U1.1 56.02,31.45 R2.1
RX  (via drill 0.5)
  Top 0.61: v66,26.5 65,27.5 55,27.5 50.5,27.5 | BR1.5 20.08,29.92 22.5,27.5 50.5,27.5 | U1.3 50.76,27.75 50.5,27.5
  Bottom 0.61: SV1.3 90.02,18.75 82.58,18.75 81.07,20.26 71.74,20.26 66,26 v66,26.5
SCK
  Top 0.61: U1.19 32.98,23.98 35,26 62.5,26 77,11.5 78.73,11.5 J2.7
  Bottom 0.61: U1.19 32.98,19.02 | R34.1 33.05,18.95 32.98,19.02 | C15.1 32.38,19.02 32.98,19.02
SCL
  Bottom 0.305: U$1.P$9 83.5,35.5 83,36 76,36 74.19,37.81 U$3.7 71.31,37.81 71,37.5 71,36.5
  Bottom 0.508: 71,36.5 71,35.5 59.15,23.65 59,23.65 U1.28
  Bottom 0.61: U1.28 55.5,23.98 R5.1 | 59,23.65 64.4,18.25 81,18.25 84.52,14.73 SV1.6
SDA  (via drill 0.5)
  Top 0.61: v61.5,24 59,21.5 55.45,21.5 U1.27
  Bottom 0.305: U$3.8 73.83,37.16 77.5,33.5 83.5,33.5 84,34 U$1.P$10 U$1.P$11
  Bottom 0.406: U$3.8 72.5,37.04 72.5,35
  Bottom 0.61: R3.1 52,24.95 U1.27 64.17,12.78 90.28,12.78 91.5,14 SV1.4 | 72.5,35 v61.5,24
TX
  Top 0.406: 47.5,28.5 48,28.5 49.5,30 49.5,32.5 50,33 52.09,33 53.3,31.8
  Top 0.61: U1.2 53.3,31.8 55,33.5 57.5,33.5 60.5,30.5 70.5,30.5 83.73,17.27 SV1.5 | BR1.6 19.75,32.24 22,30 23.5,28.5 29.5,28.5 47.5,28.5
V+
  Top 1.27: R11.2 93.2,30.8 X1.P$2
  Bottom 0.305: U$1.P$1 93.05,30.95 X1.P$2
V-
  Top 1.27: R12.1 92.93,34.93 X1.P$3
  Bottom 0.305: X1.P$3 91.5,33.5 87,33.5 86.5,34 U$1.P$15
V_USB
  Top 0.508: J1.VBUS 9.41,25.6 10.29,26.48
  Top 0.61: 10.29,26.48 10.29,29.66 9.03,30.92 8.95,30.85 D6.A
VCTRL
  Bottom 0.508: IC1.5 64.4,41.05 R17.2 | IC1.3 67.69,43.87 67.05,43.23 R18.2
  Bottom 0.61: R17.2 64.55,41 R18.2
VENC
  Bottom 0.813: S2.SW+ 26.96,4.01 | R30.1 26.92,4.05 26.96,4.01 | R31.2 26.96,4.01
VENCA
  Bottom 0.61: R35.2 34.5,14.3 R34.2 33.94,16.49 S2.A
VENCB
  Bottom 0.61: S2.B 26.96,14.88 R33.2 28.43,14.36 R32.1
VFB1
  Bottom 0.508: IC1.2 72.78,45.13 R19.2 R20.2
VFB2
  Bottom 0.508: R22.2 61.41,43.87 IC1.6 66.11,43.87 67.5,45.25 67.5,48.25 R23.2
VG2
  Bottom 0.508: U$4.G 54.91,51.94 R24.1
VIN
  Top 1.27: X1.P$1 93.2,25.2 R11.1
  Bottom 0.305: U$1.P$2 86.5,30 89.25,27.25 89.25,26.25 90,25.5 X1.P$1
VO1
  Bottom 0.508: IC1.1 70.69,47.5 C11.2
  Bottom 0.61: C11.2 R21.2
VO2
  Bottom 0.508: IC1.7 61.31,45.13 C12.2 R24.2
VS1
  Bottom 0.61: R16.2 86.31,49.78 79.82,43.3 R20.1
  Bottom 1.27: R16.2 91.09,50.92 U$5.S
VS2
  Bottom 0.508: R23.1 67.55,50.3 69.25,52 69.25,53.45 R25.2
  Bottom 1.27: U$4.S 66.17,53.5 R25.2
VT  (via drill 0.5)
  Top 0.61: TH1.1 55.51,47.5 61.5,47.5 76,33 v86,33
  Bottom 0.305: v86,33 U$1.P$3 86,29 87.58,27.42 R27.1

### Text on the board
bDocu: Electronic DC Load / XB 01/2020 | JLCJLCJLCJLC